# Altium schematic sheet Sheet1.SchDoc
size A4; SheetNumber: 1; SheetTotal: 1
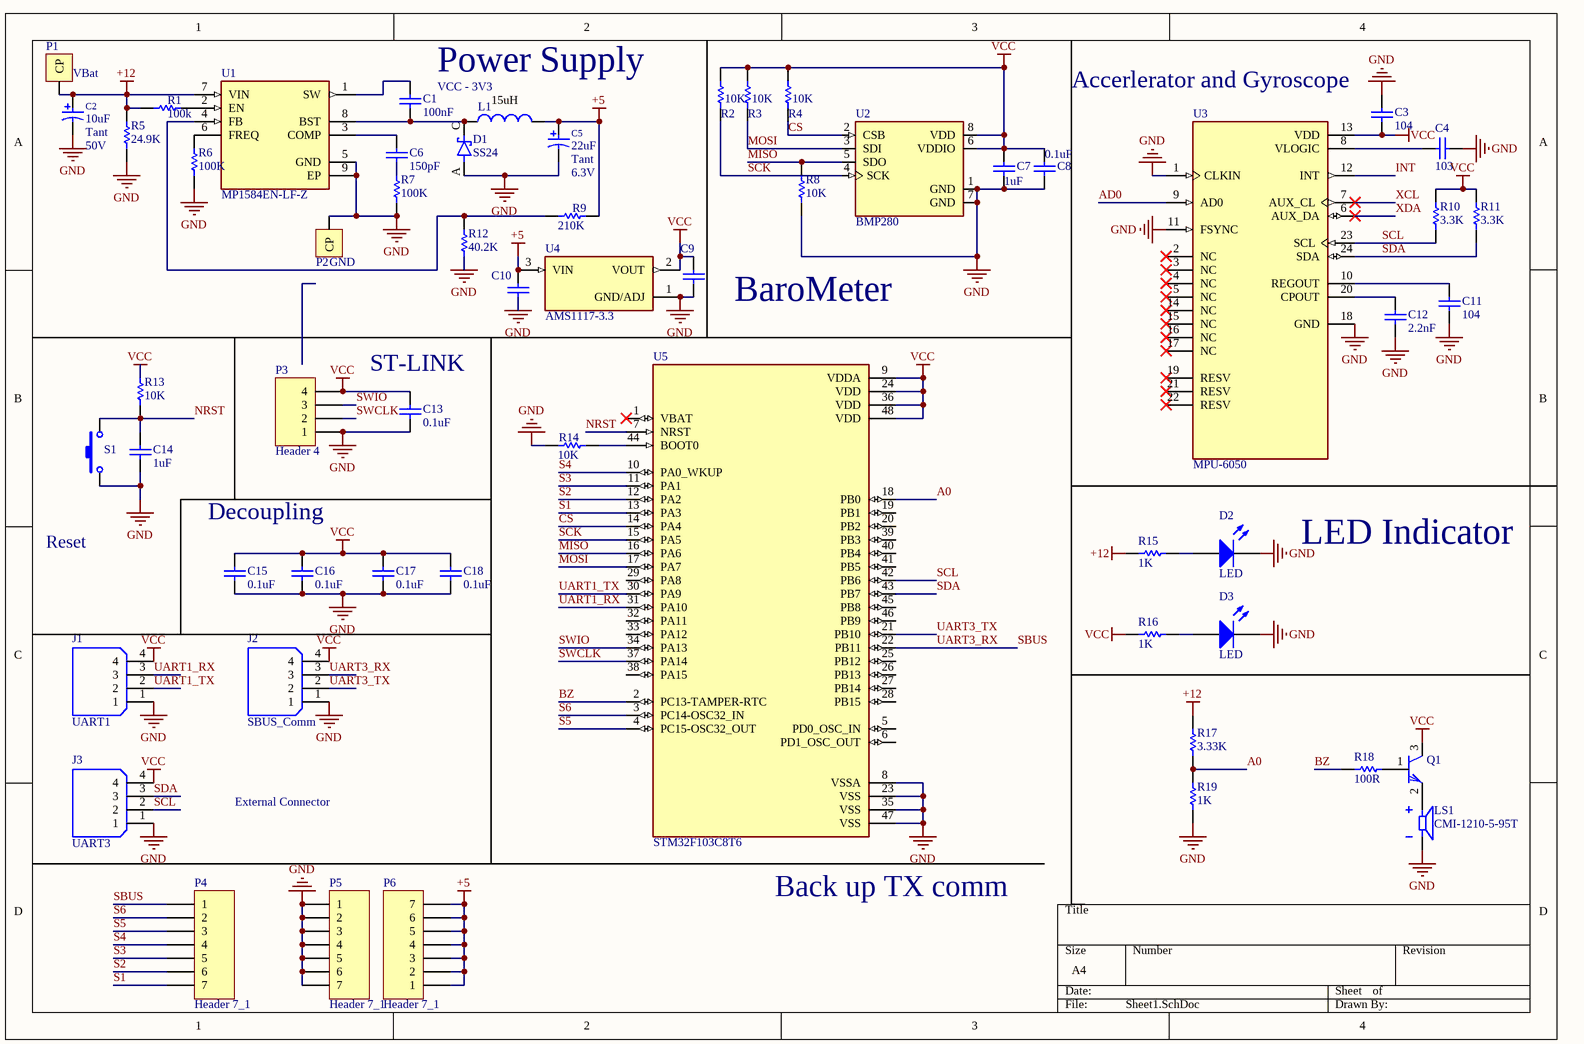
[diagram p0: Sheet1.SchDoc]

## Parts
C1  value 100nF  [C-NP-0805]  (hidden comment: Cap Non-pol)
C2  Capacitor Type: Tant  Volt: 50V  [Cap_smd_4_3MM]  (hidden comment: 10uF)
C3  value 104  [C-NP-0805]  (hidden comment: Cap Non-pol)
C4  value 103  [C-NP-0805]  (hidden comment: Cap Non-pol)
C5  Capacitor Type: Tant  Volt: 6.3V  [Cap_smd_4_3MM]  (hidden comment: 22uF)
C6  value 150pF  [C-NP-0805]  (hidden comment: Cap Non-pol)
C7  value 1uF  [C-NP-0805]  (hidden comment: Cap Non-pol)
C8  value 0.1uF  [C-NP-0805]  (hidden comment: Cap Non-pol)
C9  Cap Non-pol  [C-NP-0805]  (value not drawn)
C10  Cap Non-pol  [C-NP-0805]  (value not drawn)
C11  value 104  [C-NP-0805]  (hidden comment: Cap Non-pol)
C12  value 2.2nF  [C-NP-0805]  (hidden comment: Cap Non-pol)
C13  value 0.1uF  [C-NP-0805]  (hidden comment: Cap Non-pol)
C14  value 1uF  [C-NP-0805]  (hidden comment: Cap Non-pol)
C15  value 0.1uF  [C-NP-0805]  (hidden comment: Cap Non-pol)
C16  value 0.1uF  [C-NP-0805]  (hidden comment: Cap Non-pol)
C17  value 0.1uF  [C-NP-0805]  (hidden comment: Cap Non-pol)
C18  value 0.1uF  [C-NP-0805]  (hidden comment: Cap Non-pol)
D1  SS24  [DIOM5336X265N]
D2  LED  [LED-0805 GREEN]
D3  LED  [LED-0805 GREEN]
J1  UART1  [AMPHENOL_10114830-11104LF]
J2  SBUS_Comm  [AMPHENOL_10114830-11104LF]
J3  UART3  [AMPHENOL_10114830-11104LF]
L1  value 15uH  [IMPE7-RS1]
LS1  CMI-1210-5-95T  [XDCR_CMI-1210-5-95T]
P1  VBat  [CP]
P2  GND  [CP]
P3  Header 4  [Header 4]
P4  Header 7_1  [HDR1X7]
P5  Header 7_1  [HDR1X7]
P6  Header 7_1  [HDR1X7]
Q1  C1815  [SOT23 [C1815]]  (value not drawn)
R1  value 100k  [R-0805]  (hidden comment: RESISTOR)
R2  value 10K  [R-0805]  (hidden comment: RESISTOR)
R3  value 10K  [R-0805]  (hidden comment: RESISTOR)
R4  value 10K  [R-0805]  (hidden comment: RESISTOR)
R5  value 24.9K  [R-0805]  (hidden comment: RESISTOR)
R6  value 100K  [R-0805]  (hidden comment: RESISTOR)
R7  value 100K  [R-0805]  (hidden comment: RESISTOR)
R8  value 10K  [R-0805]  (hidden comment: RESISTOR)
R9  value 210K  [R-0805]  (hidden comment: RESISTOR)
R10  value 3.3K  [R-0805]  (hidden comment: RESISTOR)
R11  value 3.3K  [R-0805]  (hidden comment: RESISTOR)
R12  value 40.2K  [R-0805]  (hidden comment: RESISTOR)
R13  value 10K  [R-0805]  (hidden comment: RESISTOR)
R14  value 10K  [R-0805]  (hidden comment: RESISTOR)
R15  value 1K  [R-0805]  (hidden comment: RESISTOR)
R16  value 1K  [R-0805]  (hidden comment: RESISTOR)
R17  value 3.33K  [R-0805]  (hidden comment: RESISTOR)
R18  value 100R  [R-0805]  (hidden comment: RESISTOR)
R19  value 1K  [R-0805]  (hidden comment: RESISTOR)
S1  SW-SMD  [SW-SMD]  (value not drawn)
U1  MP1584EN-LF-Z  [SOIC127P600X170-9N]
U2  BMP280  [XDCR_BMP280]
U3  MPU-6050  [QFN50P400X400X95-24N]
U4  AMS1117-3.3  [SOT229P700X180-4N]
U5  STM32F103C8T6  [QFP50P900X900X160-48N]

## Nets
+5: C5.1 C10.1 L1.2 P6.1 P6.2 P6.3 P6.4 P6.5 P6.6 P6.7 R9.1 U4.3(VIN)
+12: C2.1 P1.1(CP) R1.1 R5.2 R15.2 R17.1 U1.7(VIN)
GND: C2.2 C3.2 C4.2 C5.2 C7.2 C8.2 C9.1 C10.2 C11.1 C12.1 C13.2 C14.2 C15.2 C16.2 C17.2 C18.2 D1.A D2.2(K) D3.2(K) J1.1 J2.1 J3.1 LS1.N P2.1(CP) P3.1 P5.1 P5.2 P5.3 P5.4 P5.5 P5.6 P5.7 R5.1 R6.1 R7.1 R8.2 R12.2 R14.2 R19.2 S1.1 U1.5(GND) U1.9(EP) U2.1(GND) U2.7(GND) U3.1(CLKIN) U3.11(FSYNC) U3.18(GND) U4.1(GND/ADJ) U5.8(VSSA) U5.23(VSS) U5.35(VSS) U5.47(VSS)
VCC: C3.1 C7.1 C8.1 C9.2 C13.1 C15.1 C16.1 C17.1 C18.1 J1.4 J2.4 J3.4 P3.4 Q1.3(C) R2.1 R3.1 R4.1 R10.1 R11.1 R13.1 R16.2 U2.6(VDDIO) U2.8(VDD) U3.13(VDD) U4.2(VOUT) U5.9(VDDA) U5.24(VDD) U5.36(VDD) U5.48(VDD)
\: J1.3 U5.31(PA10)  [also labelled UART1_RX]
A0: R17.2 R19.1 U5.18(PB0)
AD0: U3.9(AD0)
BZ: R18.1 U5.2(PC13-TAMPER-RTC)
CS: R4.2 U2.2(CSB) U5.14(PA4)
INT: U3.12(INT)
MISO: R8.1 U2.5(SDO) U5.16(PA6)
MOSI: R3.2 U2.3(SDI) U5.17(PA7)
NRST: C14.1 R13.2 S1.2 U5.7(NRST)
S1: P4.7 U5.13(PA3)
S2: P4.6 U5.12(PA2)
S3: P4.5 U5.11(PA1)
S4: P4.4 U5.10(PA0_WKUP)
S5: P4.3 U5.4(PC15-OSC32_OUT)
S6: P4.2 U5.3(PC14-OSC32_IN)
SBUS: J2.3 P4.1 U5.22(PB11)  [also labelled UART3_RX]
SCK: R2.2 U2.4(SCK) U5.15(PA5)
SCL: J3.2 R10.2 U3.23(SCL) U5.42(PB6)
SDA: J3.3 R11.2 U3.24(SDA) U5.43(PB7)
SWCLK: P3.2 U5.37(PA14)
SWIO: P3.3 U5.34(PA13)
UART1_TX: J1.2 U5.30(PA9)
UART3_TX: J2.2 U5.21(PB10)
XCL: U3.7(AUX_CL)
XDA: U3.6(AUX_DA)
NetC1_1: C1.1 U1.1(SW)
NetC1_2: C1.2 D1.C(K) L1.1 U1.8(BST)
NetC4_1: C4.1 U3.8(VLOGIC)
NetC6_1: C6.1 U1.3(COMP)
NetC6_2: C6.2 R7.2
NetC11_2: C11.2 U3.10(REGOUT)
NetC12_2: C12.2 U3.20(CPOUT)
NetD2_1: D2.1(A) R15.1
NetD3_1: D3.1(A) R16.1
NetLS1_P: LS1.P Q1.2(E)
NetQ1_1: Q1.1(B) R18.2
NetR1_2: R1.2 U1.2(EN)
NetR6_2: R6.2 U1.6(FREQ)
NetR9_2: R9.2 R12.1 U1.4(FB)
NetR14_1: R14.1 U5.44(BOOT0)

Not connected (* = marked no-connect by the designer): U3 2(NC)* 3(NC)* 4(NC)* 5(NC)* 14(NC)* 15(NC)* 16(NC)* 17(NC)* 19(RESV)* 21(RESV)* 22(RESV)*; U5 1(VBAT)* 5(PD0_OSC_IN) 6(PD1_OSC_OUT) 19(PB1) 20(PB2) 25(PB12) 26(PB13) 27(PB14) 28(PB15) 29(PA8) 32(PA11) 33(PA12) 38(PA15) 39(PB3) 40(PB4) 41(PB5) 45(PB8) 46(PB9)

## Notes on the sheet
- Power Supply
- VCC - 3V3
- (near C3) Accerlerator and Gyroscope
- (near C9) BaroMeter
- (near C13) ST-LINK
- Decoupling
- Reset
- LED Indicator
- External Connector
- (near U5) Back up TX comm

## Library data of the parts
C1 C3 C4 C6-C18 = Cap Non-pol: Non-polarized Capacitor; Published: 8-Jun-2000; LatestRevisionDate: 17-Jul-2002; LatestRevisionNote: Re-released for DXP Platform.; PackageReference: RAD-0.3; Publisher: Altium Limited
C2 C5 = Cap_Pol: Polarized Capacitor; Manufacturer: FARNELL; AEMS Code: 2100110; Vendor: Digikey; Published: 13-April-2009; Publisher: Hoang Nguyen; ComponentLink1Description: Digikey Part Link; ComponentLink2Description: Open Datasheet; ComponentLink2URL: H:\LIBRARY\LIBRARY.Datasheet\
  C2: Value: 10uF
  C5: Value: 22uF
D1 = SS24: Diode Schottky 40V 2A Surface Mount DO-214AA (SMB); MF: ON Semiconductor; Package: DO-214AA ON Semiconductor; Price: None; Value: *; SnapEDA_Link: https://www.snapeda.com/parts/SS24/Onsemi/view-part/?ref=snap; MP: SS24; Availability: In Stock; Check_prices: https://www.snapeda.com/parts/SS24/Onsemi/view-part/?ref=eda
D2 D3 = LED: Typical LED; Published: 8-Jun-2000; LatestRevisionDate: 08-Jul-2005; LatestRevisionNote: Mech Layer 1 removed.; PackageReference: LED-1; Publisher: Altium Limited
J1-J3 = 10114830-11104LF: MF: {'manufacturer': u'Amphenol ICC (FCI)'}; Package: None; Price: None; Value: *; MP: 10114830-11104LF; Availability: Unavailable
L1 = Inductor_1: Cuon Cam L; Code_IEC: 1005; Vendor: Digikey; Published: 8-Jun-2000; LatestRevisionDate: 17-Jul-2002; LatestRevisionNote: Re-released for DXP Platform.; PackageReference: 0402-A; Publisher: Altium Limited; Code_JEITA: 0402; ComponentLink1Description: Digikey Part Link; ComponentLink2Description: Open Datasheet; ComponentLink2URL: H:\LIBRARY\LIBRARY.Datasheet\
LS1 = CMI-1210-5-95T: 12 mm, 5 Vdc, 98 dB, Through Hole, Magnetic Audio Indicator Buzzer; MF: Same Sky; SnapEDA_Link: https://www.snapeda.com/parts/CMI-1210-5-95T/Same+Sky/view-part/?ref=snap; Package: None; Value: *; MP: CMI-1210-5-95T; Check_prices: https://www.snapeda.com/parts/CMI-1210-5-95T/Same+Sky/view-part/?ref=eda
P1 P2 = Connect Pad: Connect Pad, 1-Pin; LatestRevisionDate: 17-Jul-2002; LatestRevisionNote: Re-released for DXP Platform.; Publisher: Altium Limited
P3 = Header 4: Header, 4-Pin; LatestRevisionDate: 17-Jul-2002; LatestRevisionNote: Re-released for DXP Platform.; Publisher: Altium Limited
P4-P6 = Header 7_1: Header, 7-Pin; LatestRevisionDate: 17-Jul-2002; LatestRevisionNote: Re-released for DXP Platform.; Publisher: Altium Limited
Q1 = C1815: Q2SC1815; PSpiceTemplate: Q^@REFDES %c %b %e @MODEL; Vendor: Digikey; COMPONENT: 2SC1815; Published: 13-April-2009; Publisher: Hoang Nguyen; ComponentLink1Description: Digikey Part Link; ComponentLink2Description: Open Datasheet; ComponentLink2URL: H:\LIBRARY\LIBRARY.Datasheet\; Price: 500VND
S1 = SW-SMD: Switch; Published: 24-Mar-1999; LatestRevisionDate: 17-Jul-2002; LatestRevisionNote: Re-released for DXP Platform.; PackageReference: SPST-2; Publisher: Altium Limited
U1 = MP1584EN-LF-Z: Buck Switching Regulator IC Positive Adjustable 0.8V 1 Output 3A 8-SOIC (0.154, 3.90mm Width) Exposed Pad; MF: Monolithic Power Systems; MP: MP1584ENLFZ; SnapEDA_Link: https://www.snapeda.com/parts/MP1584ENLFZ/Monolithic+Power+Systems/view-part/?ref=snap; Package: SOIC-8 Monolithic Power Systems; Value: *; Check_prices: https://www.snapeda.com/parts/MP1584ENLFZ/Monolithic+Power+Systems/view-part/?ref=eda
U2 = BMP280: BMP280 Absolute Barometric Pressure Sensor for Battery Powered Devices 2 x 2.5mm; Package: None; Availability: Unavailable; MP: BMP280; Value: *; Price: None
U3 = MPU-6050: MPU-6050 series Accelerometer, Gyroscope, 3 Axis Sensor Evaluation Board; MF: TDK InvenSense; SnapEDA_Link: https://www.snapeda.com/parts/MPU-6050/TDK+InvenSense/view-part/?ref=snap; Package: QFN-24 InvenSense; Value: *; MP: MPU-6050; Check_prices: https://www.snapeda.com/parts/MPU-6050/TDK+InvenSense/view-part/?ref=eda
U4 = AMS1117-3.3: Sot223/Pkg 1-Amp 3.3-Volt Low Drop Out Voltage Regulatator; MF: Advanced Monolithic Systems; Package: SOT-223 Seeed Technology; Value: *; Check_prices: https://www.snapeda.com/parts/AMS1117-3.3/Advanced+Monolithic+Systems/view-part/?ref=eda; Price: None; Availability: Not in stock; MP: AMS1117-3.3; SnapEDA_Link: https://www.snapeda.com/parts/AMS1117-3.3/Advanced+Monolithic+Systems/view-part/?ref=snap
U5 = STM32F103C8T6: ARM® Cortex®-M3 STM32F1 Microcontroller IC 32-Bit 72MHz 64KB (64K x 8) FLASH 48-LQFP (7x7); MF: STMicroelectronics; SnapEDA_Link: https://www.snapeda.com/parts/STM32F103C8T6/STMicroelectronics/view-part/?ref=snap; Package: LQFP-48 STMicroelectronics; Value: *; MP: STM32F103C8T6; Check_prices: https://www.snapeda.com/parts/STM32F103C8T6/STMicroelectronics/view-part/?ref=eda
R1-R19 = RESISTOR: Published: 8-Jun-2000; LatestRevisionDate: 17-Jul-2002; LatestRevisionNote: Re-released for DXP Platform.; PackageReference: AXIAL-0.3; Publisher: Altium Limited